# Altium schematic sheet Sheet2.SchDoc
size A4
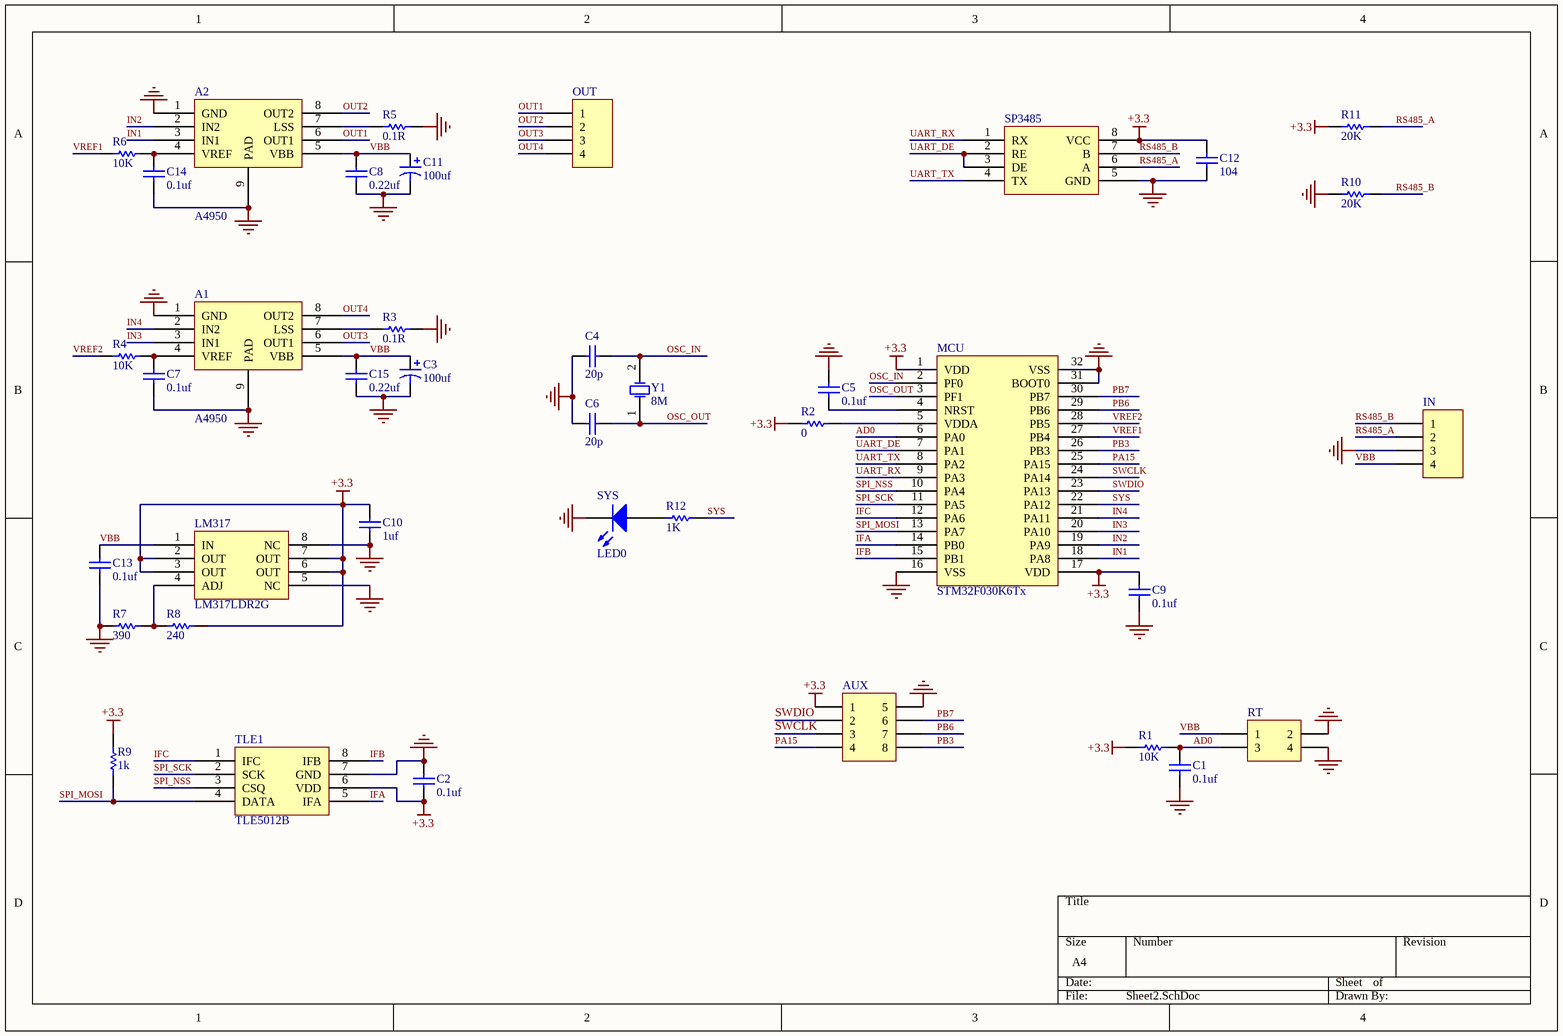
[diagram p0: Sheet2.SchDoc]

## Parts
A1  A4950  [SOIC-8P]
A2  A4950  [SOIC-8P]
AUX  Header 4X2A  [HDR2X4]  (value not drawn)
C1  value 0.1uf  [0603]  (hidden comment: Cap)
C2  value 0.1uf  [0603]  (hidden comment: Cap)
C3  value 100uf  [RB.1/.2-F]  (hidden comment: Cap Pol1)
C4  value 20p  [0603]  (hidden comment: Cap)
C5  value 0.1uf  [0603]  (hidden comment: Cap)
C6  value 20p  [0603]  (hidden comment: Cap)
C7  value 0.1uf  [0603]  (hidden comment: Cap)
C8  value 0.22uf  [0603]  (hidden comment: Cap)
C9  value 0.1uf  [0603]  (hidden comment: Cap)
C10  value 1uf  [0603]  (hidden comment: Cap)
C11  value 100uf  [RB.1/.2-F]  (hidden comment: Cap Pol1)
C12  value 104  [0603]  (hidden comment: Cap)
C13  value 0.1uf  [0603]  (hidden comment: Cap)
C14  value 0.1uf  [0603]  (hidden comment: Cap)
C15  value 0.22uf  [0603]  (hidden comment: Cap)
IN  Header 4  [KF2EDG3.81-4P]  (value not drawn)
LM317  LM317LDR2G  [SOIC-8]
MCU  STM32F030K6Tx  [LQFP-32]
OUT  Header 4  [HDR4X1-2.54-R]  (value not drawn)
R1  value 10K  [0603]  (hidden comment: Res1)
R2  value 0  [0603]  (hidden comment: Res1)
R3  value 0.1R  [1206]  (hidden comment: Res1)
R4  value 10K  [0603]  (hidden comment: Res1)
R5  value 0.1R  [1206]  (hidden comment: Res1)
R6  value 10K  [0603]  (hidden comment: Res1)
R7  value 390  [0603]  (hidden comment: Res1)
R8  value 240  [0603]  (hidden comment: Res1)
R9  value 1k  [0603]  (hidden comment: Res1)
R10  value 20K  [0603]  (hidden comment: Res1)
R11  value 20K  [0603]  (hidden comment: Res1)
R12  value 1K  [0603]  (hidden comment: Res1)
RT  Header 2X2  [HDR2X2]  (value not drawn)
SP3485  SP3485  [SOIC-8]  (value not drawn)
SYS  LED0  [0603]
TLE1  TLE5012B  [SOIC-8]
Y1  8M  [XTAL-1]

## Nets
+3.3: AUX.1 C2.1 C9.2 C10.2 C12.2 LM317.2(OUT) LM317.3(OUT) LM317.6(OUT) LM317.7(OUT) MCU.1(VDD) MCU.17(VDD) R1.1 R2.2 R8.1 R9.1 R11.1 SP3485.8(VCC) TLE1.6(VDD)
GND: A1.1(GND) A1.9(PAD) A2.1(GND) A2.9(PAD) AUX.5 C1.2 C2.2 C3.2 C4.2 C5.2 C6.2 C7.1 C8.1 C9.1 C10.1 C11.2 C12.1 C13.1 C14.1 C15.1 IN.3 LM317.5(NC) LM317.8(NC) MCU.16(VSS) MCU.31(BOOT0) MCU.32(VSS) R3.2 R5.2 R7.2 R10.1 RT.2 RT.4 SP3485.5(GND) SYS.2(K) TLE1.7(GND)
AD0: C1.1 MCU.6(PA0) R1.2 RT.3
IFA: MCU.14(PB0) TLE1.5(IFA)
IFB: MCU.15(PB1) TLE1.8(IFB)
IFC: MCU.12(PA6) TLE1.1(IFC)
IN1: A2.3(IN1) MCU.18(PA8)
IN2: A2.2(IN2) MCU.19(PA9)
IN3: A1.3(IN1) MCU.20(PA10)
IN4: A1.2(IN2) MCU.21(PA11)
OSC_IN: C4.1 MCU.2(PF0) Y1.2(OSC2)
OSC_OUT: C6.1 MCU.3(PF1) Y1.1(OSC1)
OUT1: A2.6(OUT1) OUT.1
OUT2: A2.8(OUT2) OUT.2
OUT3: A1.6(OUT1) OUT.3
OUT4: A1.8(OUT2) OUT.4
PA15: AUX.4 MCU.25(PA15)
PB3: AUX.8 MCU.26(PB3)
PB6: AUX.7 MCU.29(PB6)
PB7: AUX.6 MCU.30(PB7)
RS485_A: IN.2 R11.2 SP3485.6(A)
RS485_B: IN.1 R10.2 SP3485.7(B)
SPI_MOSI: MCU.13(PA7) R9.2 TLE1.4(DATA)
SPI_NSS: MCU.10(PA4) TLE1.3(CSQ)
SPI_SCK: MCU.11(PA5) TLE1.2(SCK)
SWCLK: AUX.3 MCU.24(PA14)
SWDIO: AUX.2 MCU.23(PA13)
SYS: MCU.22(PA12) R12.1
UART_DE: MCU.7(PA1) SP3485.2(RE) SP3485.3(DE)
UART_RX: MCU.9(PA3) SP3485.1(RX)
UART_TX: MCU.8(PA2) SP3485.4(TX)
VBB: A1.5(VBB) A2.5(VBB) C3.1 C8.2 C11.1 C13.2 C15.2 IN.4 LM317.1(IN) RT.1
VREF1: MCU.27(PB4) R6.2
VREF2: MCU.28(PB5) R4.2
NetA1_4: A1.4(VREF) C7.2 R4.1
NetA1_7: A1.7(LSS) R3.1
NetA2_4: A2.4(VREF) C14.2 R6.1
NetA2_7: A2.7(LSS) R5.1
NetC5_1: C5.1 MCU.4(NRST)
NetLM317_4: LM317.4(ADJ) R7.1 R8.2
NetMCU_5: MCU.5(VDDA) R2.1
NetR12_2: R12.2 SYS.1(A)

## Library data of the parts
AUX = Header 4X2A: Header, 4-Pin, Dual row; LatestRevisionDate: 17-Jul-2002; LatestRevisionNote: Re-released for DXP Platform.; Publisher: Altium Limited
C1 C2 C4-C10 C12-C15 = Cap: Capacitor; Published: 8-Jun-2000; LatestRevisionDate: 17-Jul-2002; LatestRevisionNote: Re-released for DXP Platform.; PackageReference: RAD-0.3; Publisher: Altium Limited; PackageDescription: Radial Cap, Thru-Hole; 2 Leads; 0.3 in Pin Spacing
C3 C11 = Cap Pol1: Polarized Capacitor (Radial); Published: 8-Jun-2000; LatestRevisionDate: 17-Jul-2002; LatestRevisionNote: Re-released for DXP Platform.; PackageReference: RB7.6-15; Publisher: Altium Limited; PackageDescription: Polarized Capacitor (Radial); 2 Leads
IN OUT = Header 4: Header, 4-Pin; LatestRevisionDate: 17-Jul-2002; LatestRevisionNote: Re-released for DXP Platform.; Publisher: Altium Limited
R1-R12 = Res1: Resistor; Published: 8-Jun-2000; LatestRevisionDate: 17-Jul-2002; LatestRevisionNote: Re-released for DXP Platform.; PackageReference: AXIAL-0.3; Publisher: Altium Limited; PackageDescription: Axial Device, Thru-Hole; 2 Leads; 0.3 in Pin Spacing
RT = Header 2X2: Header, 2-Pin, Dual row; LatestRevisionDate: 17-Jul-2002; LatestRevisionNote: Re-released for DXP Platform.; Publisher: Altium Limited
SYS = LED0: Typical INFRARED GaAs LED; Published: 8-Jun-2000; LatestRevisionDate: 08-Jul-2005; LatestRevisionNote: Mech Layer 1 removed.; PackageReference: LED-0; Publisher: Altium Limited; PackageDescription: LED; 2 Leads
Y1 = XTAL: Crystal Oscillator; Published: 8-Jun-2000; LatestRevisionDate: 17-Jul-2002; LatestRevisionNote: Re-released for DXP Platform.; PackageReference: R38; Publisher: Altium Limited; PackageDescription: Crystal, Thru-Hole; 2 Leads; Body 3.1 x 8.2 mm (Dia.xH)